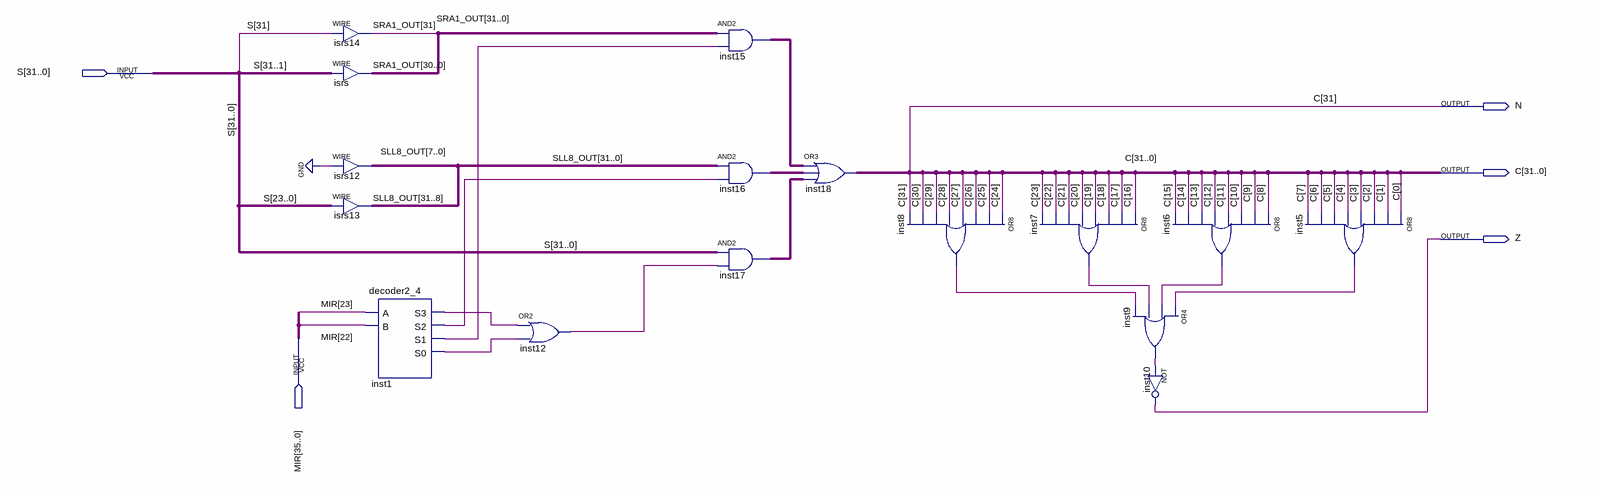
[diagram p0: schematic sheet]
// Quartus schematic shifter.bdf as structural Verilog: 16 symbols, 5 pins
module shifter (
  input  [31:0] S,
  input  [35:0] MIR,
  output N,
  output [31:0] C,
  output Z
);

  wire inst1_s0, inst1_s1, inst1_s2, inst1_s3, inst5_out, inst6_out, inst7_out, inst8_out, inst9_out,
       inst12_out;
  wire [31:0] inst15_out, inst16_out, inst17_out, SLL8_OUT, SRA1_OUT;

  assign SRA1_OUT[31] = S[31];  // WIRE isrs14
  assign SRA1_OUT[30:0] = S[31:1];  // WIRE isrs
  assign SLL8_OUT[7:0] = {8{1'b0}};  // WIRE isrs12
  assign SLL8_OUT[31:8] = S[23:0];  // WIRE isrs13
  decoder2_4 inst1 (.A(MIR[23]), .B(MIR[22]), .S3(inst1_s3), .S2(inst1_s2), .S1(inst1_s1), .S0(inst1_s0));
  or inst12 (inst12_out, inst1_s3, inst1_s0);
  assign inst15_out = SRA1_OUT & {32{inst1_s1}};  // AND2 inst15, 32 bits wide
  assign inst16_out = SLL8_OUT & {32{inst1_s2}};  // AND2 inst16, 32 bits wide
  assign inst17_out = S & {32{inst12_out}};  // AND2 inst17, 32 bits wide
  assign C = inst15_out | inst16_out | inst17_out;  // OR3 inst18, 32 bits wide
  or inst8 (inst8_out, C[24], C[25], C[26], C[27], C[28], C[29], C[30], C[31]);
  or inst7 (inst7_out, C[16], C[17], C[18], C[19], C[20], C[21], C[22], C[23]);
  or inst9 (inst9_out, inst5_out, inst6_out, inst7_out, inst8_out);
  or inst6 (inst6_out, C[8], C[9], C[10], C[11], C[12], C[13], C[14], C[15]);
  not inst10 (Z, inst9_out);
  or inst5 (inst5_out, C[0], C[1], C[2], C[3], C[4], C[5], C[6], C[7]);

  assign N = C[31];
endmodule
